# Altium schematic sheet Arduino.SchDoc: Arduino Nano Every
size A4; SheetNumber: 1; SheetTotal: 1; ENG_APP_DATE: --/--/--; DSN_APP_DATE: --/--/--; CHK_APP_DATE: --/--/--; SPICEModelCacheCJHNTGTK: <root> / <DocumentId>CJHNTGTK</DocumentId> / </root>
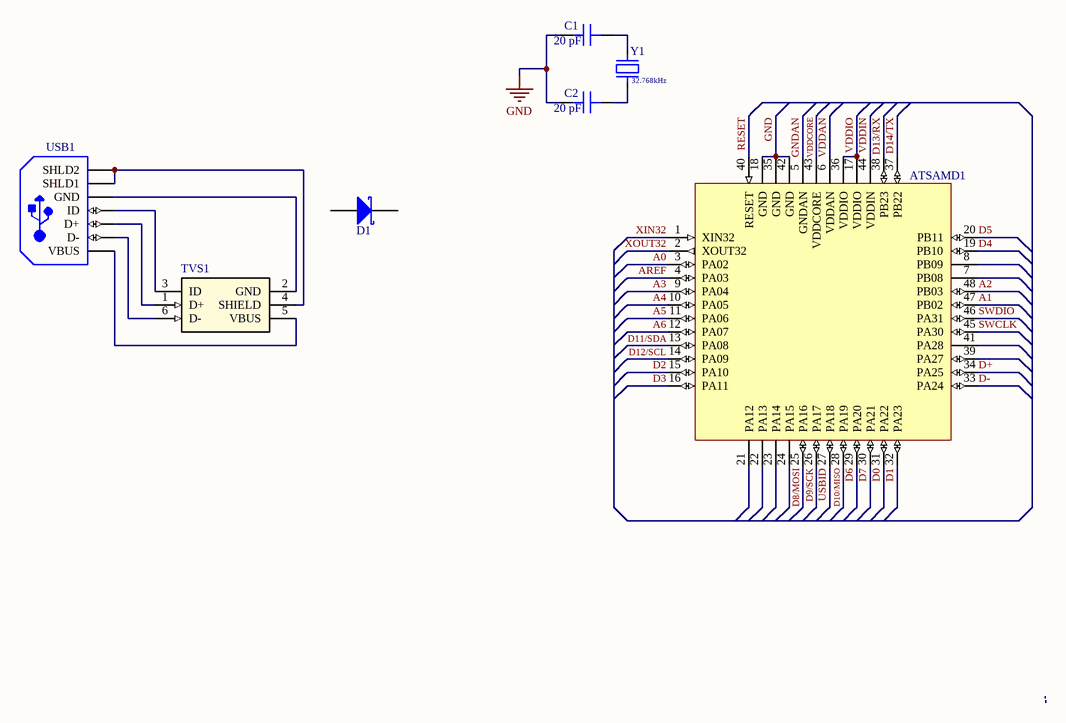
[diagram p0: Arduino.SchDoc]

## Parts
ATSAMD1  ATSAMD21G18A-AU  [ATSAMD21G18-AU]  (value not drawn)
C1  value 20 pF  [Capacitor 20 pF SMT 0603]  (hidden comment: CC0603JRNPO9BN200)
C2  value 20 pF  [Capacitor 20 pF SMT 0603]  (hidden comment: CC0603JRNPO9BN200)
D1  NSR0530HT1G  [Schottky Diode 30V SMT]  (value not drawn)
TVS1  RCLAMP0504FA.TCT  [RCLAMP0504FA.TCT]  (value not drawn)
USB1  USB3106-30-0230-A  (value not drawn)
Y1  value 32.768kHz  [ABS07-120-32.768KHZ-T A]  (hidden comment: ABS07-120-32.768KHZ-T)

## Nets
GND: ATSAMD1.18(GND) ATSAMD1.35(GND) ATSAMD1.42(GND) C1.1 C2.1
A0: ATSAMD1.3(PA02)
A1: ATSAMD1.47(PB02)
A2: ATSAMD1.48(PB03)
A3: ATSAMD1.9(PA04)
A4: ATSAMD1.10(PA05)
A5: ATSAMD1.11(PA06)
A6: ATSAMD1.12(PA07)
AREF: ATSAMD1.4(PA03)
D0: ATSAMD1.31(PA22)
D1: ATSAMD1.32(PA23)
D2: ATSAMD1.15(PA10)
D3: ATSAMD1.16(PA11)
D4: ATSAMD1.19(PB10)
D5: ATSAMD1.20(PB11)
D6: ATSAMD1.29(PA20)
D7: ATSAMD1.30(PA21)
D8/MOSI: ATSAMD1.25(PA16)
D9/SCK: ATSAMD1.26(PA17)
D10/MISO: ATSAMD1.28(PA19)
D11/SDA: ATSAMD1.13(PA08)
D12/SCL: ATSAMD1.14(PA09)
D13/RX: ATSAMD1.38(PB23)
D14/TX: ATSAMD1.37(PB22)
D+: ATSAMD1.34(PA25)
D-: ATSAMD1.33(PA24)
GNDAN: ATSAMD1.5(GNDAN)
RESET: ATSAMD1.40(RESET)
SWCLK: ATSAMD1.45(PA30)
SWDIO: ATSAMD1.46(PA31)
USBID: ATSAMD1.27(PA18)
VDDAN: ATSAMD1.6(VDDAN)
VDDCORE: ATSAMD1.43(VDDCORE)
VDDIN: ATSAMD1.44(VDDIN)
VDDIO: ATSAMD1.17(VDDIO) ATSAMD1.36(VDDIO)
XIN32: ATSAMD1.1(XIN32)
XOUT32: ATSAMD1.2(XOUT32)
NetC1_2: C1.2 Y1.2
NetC2_2: C2.2 Y1.1
NetTVS1_1: TVS1.1(D+) USB1.3(D+)
NetTVS1_2: TVS1.2(GND) USB1.5(GND)
NetTVS1_3: TVS1.3(ID) USB1.4(ID)
NetTVS1_4: TVS1.4(SHIELD) USB1.6(SHLD1) USB1.7(SHLD2)
NetTVS1_5: TVS1.5(VBUS) USB1.1(VBUS)
NetTVS1_6: TVS1.6(D-) USB1.2(D-)

Not connected (* = marked no-connect by the designer): ATSAMD1 7(PB08) 8(PB09) 21(PA12) 22(PA13) 23(PA14) 24(PA15) 39(PA27) 41(PA28); D1 1(K) 3(A)

## Notes on the sheet
- DRAWN BY
- COURSE ID
- ID NUMBER
- DATE
- IDUL
- DRAWING NO
- TITLE
- UNITS
- REV
- SHEET
- OF

## Library data of the parts
ATSAMD1 = ATSAMD21G18A-AU: ARM® Cortex®-M0+ SAM D21G, Functional Safety (FuSa) Microcontroller IC 32-Bit Single-Core 48MHz 256KB (256K x 8) FLASH 48-TQFP (7x7); Supplier 1: Digi-Key; Supplier Part Number 1: ATSAMD21G18A-AU-ND; ComponentLink1Description: Datasheet; ComponentLink1URL: https://ww1.microchip.com/downloads/en/DeviceDoc/SAM-D21-DA1-Family-Data-Sheet-DS40001882H.pdf; ComponentLink2Description: Arduino Zero; ComponentLink2URL: https://docs.arduino.cc/hardware/zero
C1 C2 = Capacitor 20 pF SMT 0603: 20 pF ±5% 50V Ceramic Capacitor C0G, NP0 0603 (1608 Metric); manufacturer: Yageo; Part Number: CC0603JRNPO9BN200; Applications: General Purpose; Capacitance: 20 pF; componentlink1description: Datasheet; componentlink1url: https://www.yageo.com/upload/media/product/productsearch/datasheet/mlcc/UPY-GP_NP0_16V-to-50V_17.pdf; componentlink2description: DigiKey Link; componentlink2url: https://www.digikey.com/en/products/detail/yageo/CC0603JRNPO9BN200/2833589; Device Package: 0603 (1608 Metric); lastupdated: 2023-03-06 20:07:50; Lifecycle Status: Active; Minimum Order: 1; Mounting Type: Surface Mount, MLCC; Operating Temperature: -55°C ~ 125°C; Package / Case: 0603 (1608 Metric); packaging: TapeAndReel; partid: 16728; Part Status: Active; price: 0.01; series: CC; Size / Dimension: 0.063" L x 0.031" W (1.60mm x 0.80mm); Temperature Coefficient: C0G, NP0; Thickness (Max): 0.035" (0.90mm); Tolerance: ±5%; Voltage - Rated: 50V; Supplier 1: Digi-Key; Supplier Part Number 1: 311-1424-1-ND; Supplier 2: Digi-Key; Supplier Part Number 2: 311-1424-6-ND; Supplier 3: Digi-Key; Supplier Part Number 3: 311-1424-2-ND
D1 = Schottky Diode 30V: Schottky Diode 30 V 500mA Surface Mount SOD-323; Manufacturer: ON Semiconductor; Capacitance @ Vr, F: 10pF @ 1V, 1MHz; Current - Average Rectified (Io): 500mA (DC); Current - Reverse Leakage @ Vr: 200µA @ 30V; Speed: Fast Recovery =< 500ns, > 200mA (Io); Voltage - DC Reverse (Vr) (Max): 30V; Voltage - Forward (Vf) (Max) @ If: 620mV @ 500mA; Part Number: NSR0530HT1G; ComponentLink1Description: Datasheet; ComponentLink1URL: http://www.onsemi.com/pub/Collateral/NSR0530H-D.PDF; ComponentLink2Description: DigiKey Link; ComponentLink2URL: http://digikey.com/product-detail/en/on-semiconductor/NSR0530HT1G/NSR0530HT1GOSCT-ND/5761654; Diode Type: Schottky; LastUpdated: 2023-03-06 21:08:52; Lifecycle Status: Active; Minimum Order: 1; Mounting Type: Surface Mount; Operating Temperature - Junction: -55°C ~ 150°C; Package / Case: SC-76, SOD-323; Packaging: TapeAndReel; PartId: 3077; Part Status: Active; Price: 0.03; Series: -; Supplier Device Package: SOD-323; Supplier 1: Digi-Key; Supplier Part Number 1: NSR0530HT1GOSCT-ND; Supplier 2: Digi-Key; Supplier Part Number 2: NSR0530HT1GOSDKR-ND; Supplier 3: Digi-Key; Supplier Part Number 3: NSR0530HT1GOSTR-ND
TVS1 = RCLAMP0504FA.TCT: 25V Clamp 6A (8/20µs) Ipp Tvs Diode Surface Mount SC-70-6; Supplier 1: Digi-Key; Supplier Part Number 1: RCLAMP0504FATCTCT-ND; Supplier 2: Digi-Key; Supplier Part Number 2: RCLAMP0504FATCTDKR-ND; Supplier 3: Digi-Key; Supplier Part Number 3: RCLAMP0504FATCTTR-ND
USB1 = USB Micro-AB Connector B: USB - Micro AB 2.0 Receptacle Connector 5 Position, Vertical, Through Hole with 2.30 mm (Standard) Shell Stakes, 5-Pin THD, RoHS, Tape and Reel; Supplier 1: Newark; Supplier Part Number 1: 18X0232
Y1 = Abracon Crystal ABS07: 32.768 kHz ±20ppm Crystal 6pF 55 kOhms 2-SMD, No Lead; Manufacturer: Abracon LLC; Operating Mode: Fundamental; Part Number: ABS07-120-32.768KHZ-T; ComponentLink1Description: Datasheet; ComponentLink1URL: https://abracon.com/Resonators/ABS07-120-32.768kHz-T.pdf; ComponentLink2Description: DigiKey Link; ComponentLink2URL: https://www.digikey.com/en/products/detail/abracon-llc/ABS07-120-32-768KHZ-T/3724043; ESR (Equivalent Series Resistance): 55 kOhms; Frequency Tolerance: ±20ppm; Height - Seated (Max): 0.035" (0.90mm); LastUpdated: 2023-03-06 20:57:22; Lifecycle Status: Active; Load Capacitance: 6pF; Minimum Order: 1; Mounting Type: Surface Mount; Operating Temperature: -40°C ~ 85°C; Package / Case: 2-SMD, No Lead; Packaging: TapeAndReel; PartId: 385; Part Status: Active; Price: 0.44; Series: ABS07; Size / Dimension: 0.126" L x 0.059" W (3.20mm x 1.50mm); Type: kHz Crystal (Tuning Fork); Supplier 1: Digi-Key; Supplier Part Number 1: 535-11937-1-ND; Supplier 2: Digi-Key; Supplier Part Number 2: 535-11937-6-ND; Supplier 3: Digi-Key; Supplier Part Number 3: 535-11937-2-ND; Frequency: 32.768 kHz